# EasyEDA Pro project ProProject_Driver_STM32F405_2023-10-07.epro, schematic Schematic1
Create Date: 2023-02-15; Page Name: P1; Project Name: Driver_STM32F415; Schematic Name: Schematic1; Update Date: 2023-02-21; Company: 嘉立创EDA; Page Size: A4; Version: V1.0
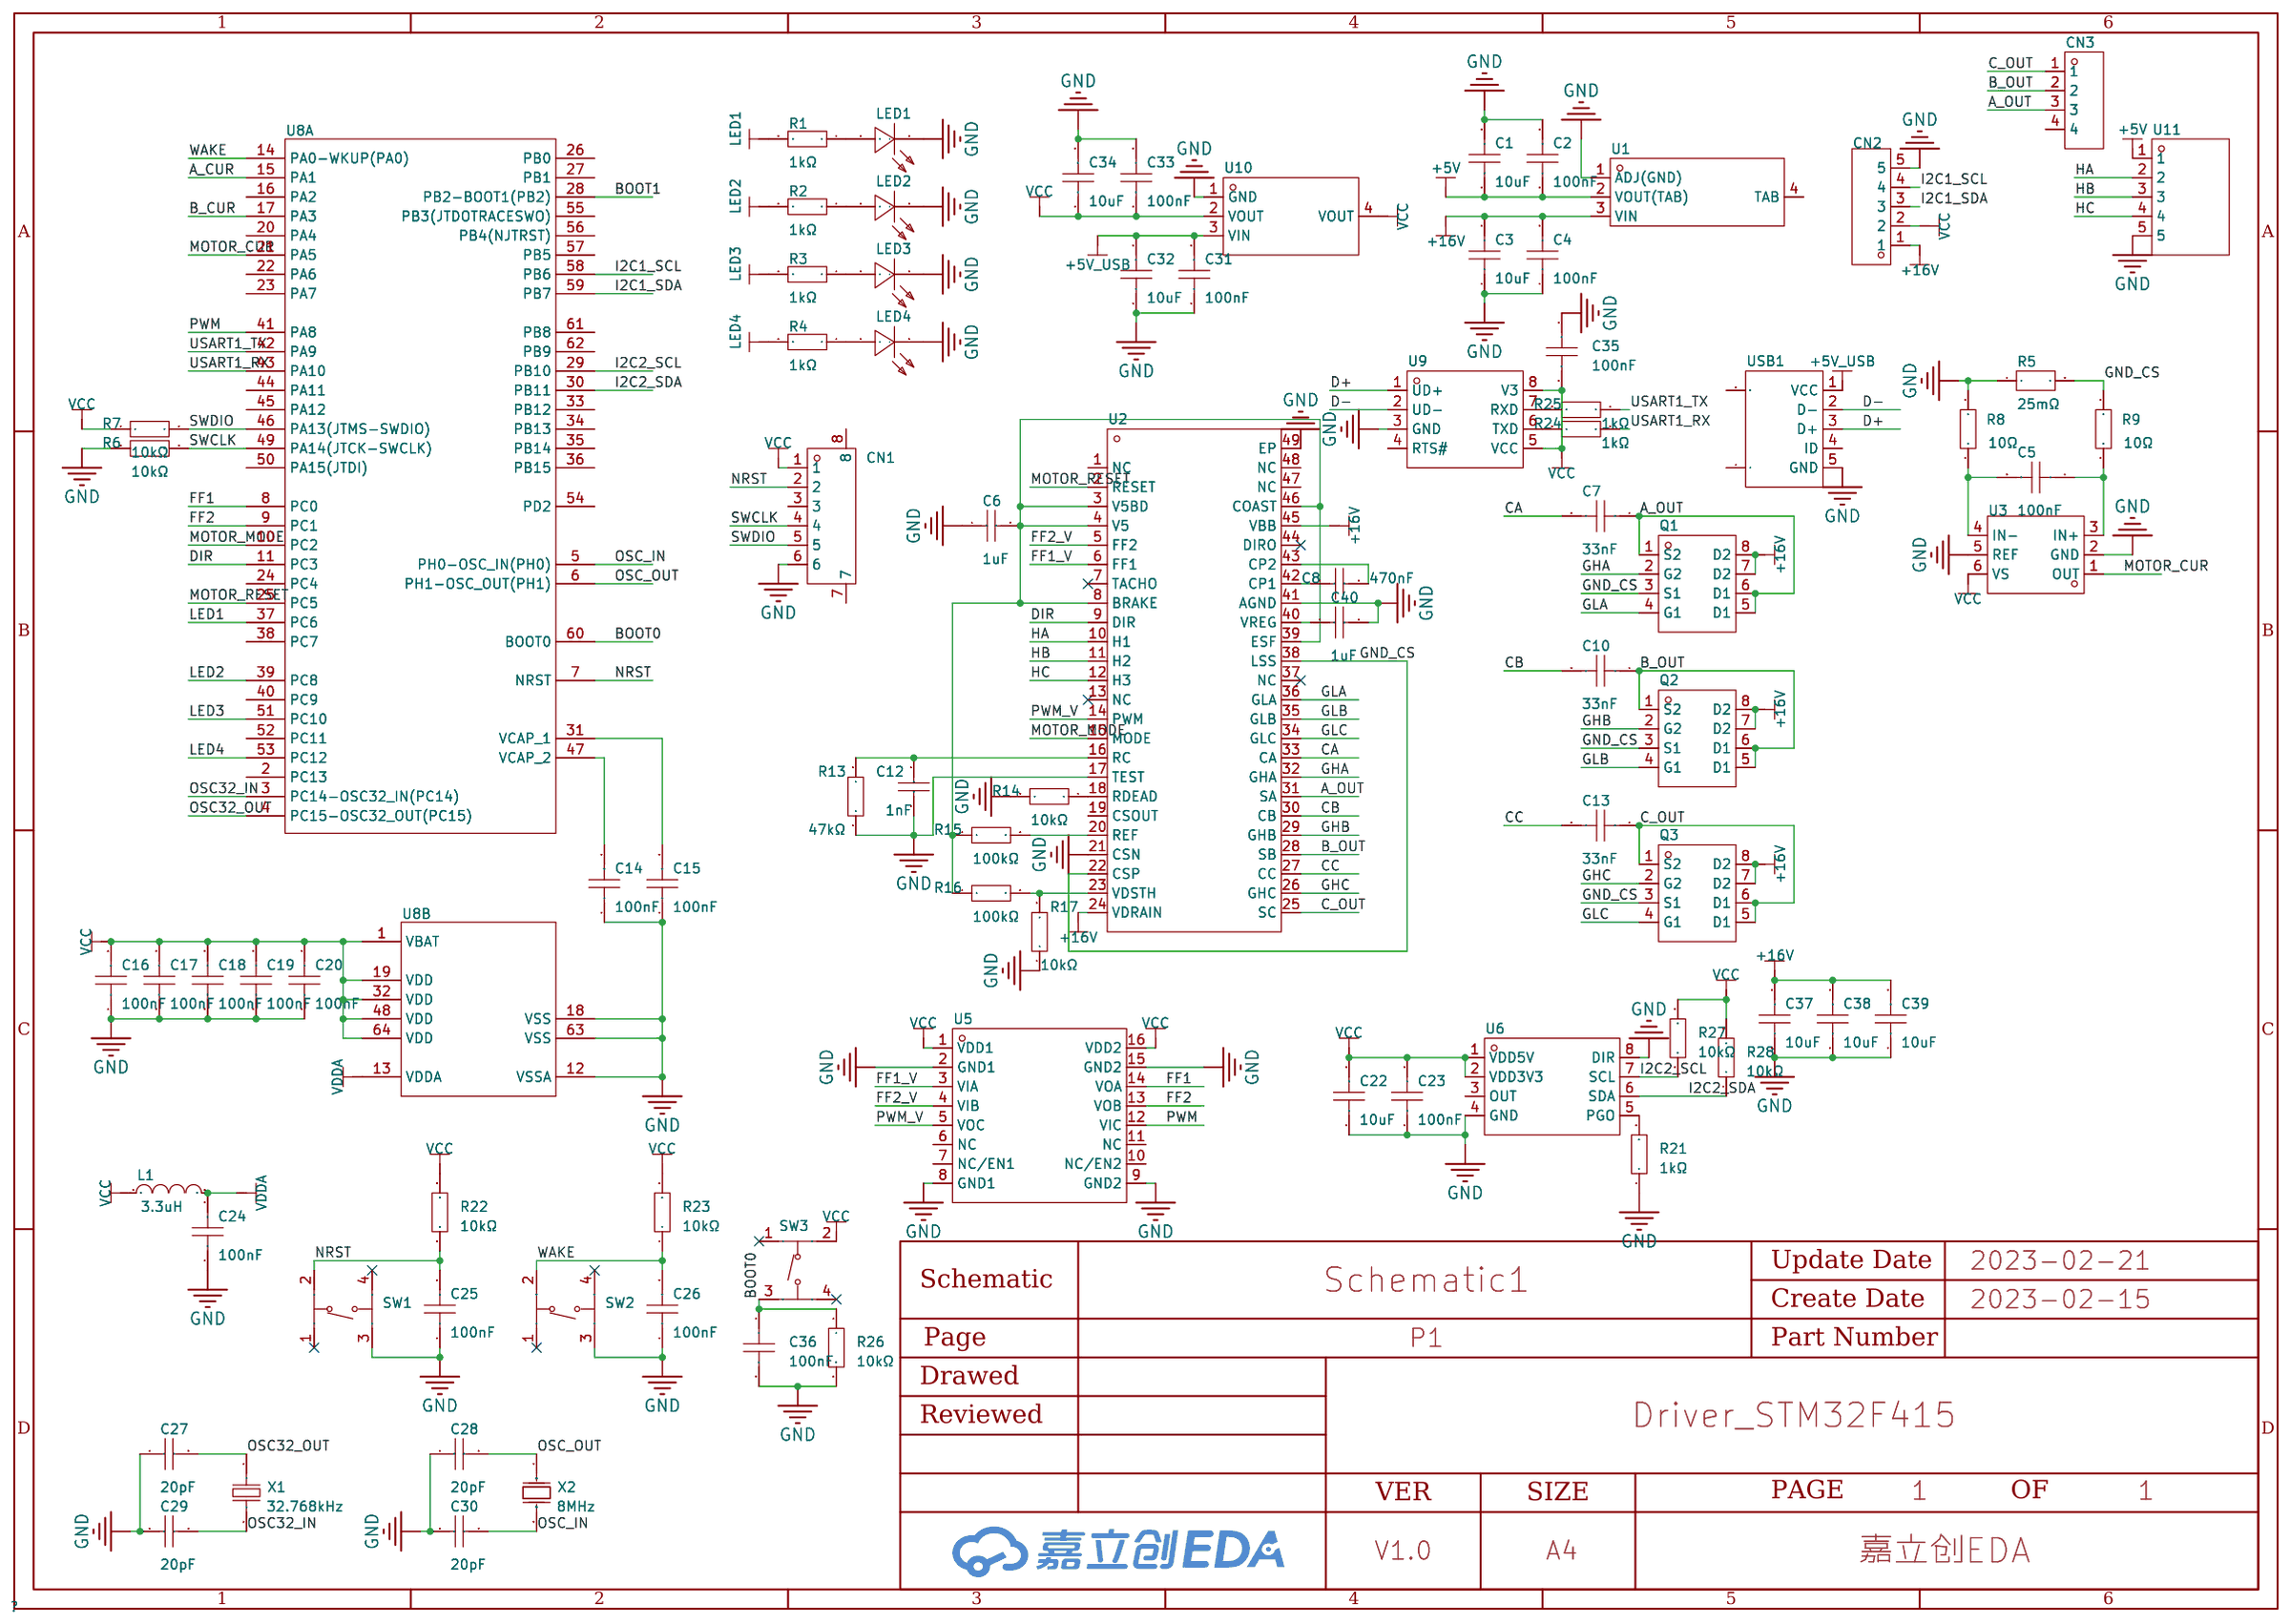
[diagram p0: schematic sheet]

## Parts
C1  10uF  [C0603]
C2  100nF  [C0603]
C3  10uF  [C0603]
C4  100nF  [C0603]
C5  100nF  [C0603]
C6  1uF  [C0603]
C7  33nF  [C0603]
C8  470nF  [C0603]
C10  33nF  [C0603]
C12  1nF  [C0603]
C13  33nF  [C0603]
C14  100nF  [C0603]
C15  100nF  [C0603]
C16  100nF  [C0603]
C17  100nF  [C0603]
C18  100nF  [C0603]
C19  100nF  [C0603]
C20  100nF  [C0603]
C22  10uF  [C0603]
C23  100nF  [C0603]
C24  100nF  [C0603]
C25  100nF  [C0603]
C26  100nF  [C0603]
C27  20pF  [C0603]
C28  20pF  [C0603]
C29  20pF  [C0603]
C30  20pF  [C0603]
C31  100nF  [C0603]
C32  10uF  [C0603]
C33  100nF  [C0603]
C34  10uF  [C0603]
C35  100nF  [C0603]
C36  100nF  [C0603]
C37  10uF  [C1206]
C38  10uF  [C1206]
C39  10uF  [C1206]
C40  1uF  [C0603]
CN1  532610671  [CONN-SMD_6P-P1.25_53261-0671]
CN2  5264-5AWD米色  [CONN-TH_5P-P2.50_5264-5AWD]
CN3  HC-HY-4AW  [CONN-TH_4P-P2.00_HCTL_HC-HY-4AW]
L1  3.3uH  [L0603]
LED1  SZYY0805B  [LED0805-R-RD_BLUE]
LED2  SZYY0805B  [LED0805-R-RD_BLUE]
LED3  SZYY0805B  [LED0805-R-RD_BLUE]
LED4  SZYY0805B  [LED0805-R-RD_BLUE]
Q1  IRF8313PBF  [SOIC-8_L4.9-W3.9-P1.27-LS6.0-BL]
Q2  IRF8313PBF  [SOIC-8_L4.9-W3.9-P1.27-LS6.0-BL]
Q3  IRF8313PBF  [SOIC-8_L4.9-W3.9-P1.27-LS6.0-BL]
R1  1kΩ  [R0603]
R2  1kΩ  [R0603]
R3  1kΩ  [R0603]
R4  1kΩ  [R0603]
R5  25mΩ  [RES-SMD_L6.4-W3.2-R2512]
R6  10kΩ  [R0603]
R7  10kΩ  [R0603]
R8  10Ω  [R0603]
R9  10Ω  [R0603]
R13  47kΩ  [R0603]
R14  10kΩ  [R0603]
R15  100kΩ  [R0603]
R16  100kΩ  [R0603]
R17  10kΩ  [R0603]
R21  1kΩ  [R0603]
R22  10kΩ  [R0603]
R23  10kΩ  [R0603]
R24  1kΩ  [R0603]
R25  1kΩ  [R0603]
R26  10kΩ  [R0603]
R27  10kΩ  [R0603]
R28  10kΩ  [R0603]
SW1  TS-1187A-B-A-B  [SW-SMD_4P-L5.1-W5.1-P3.70-LS6.5-TL-2]
SW2  TS-1187A-B-A-B  [SW-SMD_4P-L5.1-W5.1-P3.70-LS6.5-TL-2]
SW3  TS-1187A-B-A-B  [SW-SMD_4P-L5.1-W5.1-P3.70-LS6.5-TL-2]
U1  AMS1117-5.0  [SOT-223_L6.7-W3.5-P2.30-BR]
U2  A3930KJPTR-T  [LQFP-48_L7.0-W7.0-P0.50-LS9.0-BL-EP]
U3  INA181A1IDBVR  [SOT-23-6_L2.9-W1.6-P0.95-LS2.8-TL]
U5  π131M31  [SOIC-16_L9.9-W3.9-P1.27-LS6.0-BL]
U6  AS5600-ASOT  [SOIC-8_L5.0-W4.0-P1.27-LS6.0-BL]
U8  STM32F405RGT6  [LQFP-64_L10.0-W10.0-P0.50-LS12.0-BL]  (sections 1,2)
U9  CH340N  [SOP-8_L4.9-W3.9-P1.27-LS6.0-BL]
U10  AMS1117-3.3  [SOT-223-3_L6.5-W3.4-P2.30-LS7.0-BR]
U11  B5B-ZR-3.4(LF)(SN)  [CONN-TH_B5B-ZR-3.4-LF-SN]
USB1  MINI 5PTP  [MINI-USB-SMD_MINI-5PTP]
X1  32.768kHz  [FC-135R_L3.2-W1.5]
X2  8MHz  [CRYSTAL-SMD_L5.0-W3.2]

## Library data of the parts
C1 C3 C22 C32 C34 = GRM188C80G106KE47D: 容值:10uF;精度:±10%;额定电压:-;材质(温度系数):-;; LCSC Part Name: 10uF ±10%; Supplier Part: C710916; Manufacturer: muRata(村田); Supplier Footprint: 0603; JLCPCB Part Class: Extended Part; Datasheet: https://atta.szlcsc.com/upload/public/pdf/source/20210205/C710916_8901BCC8D8E6CC54F2C999D22152DEF1.pdf; Supplier: LCSC; Tolerance: ±10%
C2 C4 C5 C14-C20 C23-C26 C31 C33 C35 C36 = TCC0603X7R104K500CT: 容值:100nF;精度:±10%;额定电压:50V;材质(温度系数):X7R;; LCSC Part Name: 100nF ±10% 50V; Supplier Part: C282519; Manufacturer: CCTC(三环); Supplier Footprint: 0603; JLCPCB Part Class: Extended Part; Datasheet: https://atta.szlcsc.com/upload/public/pdf/source/20180917/C282519_8CE721FA29EE85BB321020B63D7877A0.pdf; Supplier: LCSC; Tolerance: ±10%; Voltage Rated: 50V; Temperature Coefficient: X7R
C6 C40 = CL10A105KB8NNNC: 容值:1uF;精度:±10%;额定电压:50V;材质(温度系数):X5R;; LCSC Part Name: 1uF ±10% 50V; Supplier Part: C15849; Manufacturer: SAMSUNG(三星); Supplier Footprint: 0603; JLCPCB Part Class: Basic Part; Datasheet: https://atta.szlcsc.com/upload/public/pdf/source/20160103/1457707679084.pdf; Supplier: LCSC; Tolerance: ±10%; Voltage Rated: 50V; Temperature Coefficient: X5R
C7 C10 C13 = CL10B333JB8NNNC: 容值:33nF;精度:±5%;额定电压:50V;材质(温度系数):X7R;; LCSC Part Name: 33nF ±5% 50V; Supplier Part: C377760; Manufacturer: SAMSUNG(三星); Supplier Footprint: 0603; JLCPCB Part Class: Extended Part; Datasheet: https://atta.szlcsc.com/upload/public/pdf/source/20190322/C377760_4801615B1239BA7CCDCF452430F04471.pdf; Supplier: LCSC; Tolerance: ±5%; Voltage Rated: 50V; Temperature Coefficient: X7R
C8 = 0603B474K500NT: 容值:470nF;精度:±10%;额定电压:50V;材质(温度系数):X7R;; LCSC Part Name: 470nF ±10% 50V; Supplier Part: C77572; Manufacturer: FH(风华); Supplier Footprint: 0603; JLCPCB Part Class: Extended Part; Datasheet: https://atta.szlcsc.com/upload/public/pdf/source/20170923/C77572_1506149543326988941.pdf; Supplier: LCSC; Tolerance: ±10%; Voltage Rated: 50V; Temperature Coefficient: X7R
C12 = CL10B102KB8NNNC: 容值:1nF;精度:±10%;额定电压:50V;材质(温度系数):X7R;; LCSC Part Name: 1nF ±10% 50V; Supplier Part: C1588; Manufacturer: SAMSUNG(三星); Supplier Footprint: 0603; JLCPCB Part Class: Basic Part; Datasheet: https://atta.szlcsc.com/upload/public/pdf/source/20160103/1457707679526.pdf; Supplier: LCSC; Tolerance: ±10%; Voltage Rated: 50V; Temperature Coefficient: X7R
C27-C30 = CL10C200JB8NNNC: 容值:20pF;精度:±5%;额定电压:50V;材质(温度系数):C0G;; LCSC Part Name: 20pF ±5% 50V; Supplier Part: C1648; Manufacturer: SAMSUNG(三星); Supplier Footprint: 0603; JLCPCB Part Class: Basic Part; Datasheet: https://atta.szlcsc.com/upload/public/pdf/source/20160103/1457707686863.pdf; Supplier: LCSC; Tolerance: ±5%; Voltage Rated: 50V; Temperature Coefficient: C0G
C37-C39 = GRM31CB31H106KA12L: 容值:10uF;精度:±10%;额定电压:50V;材质(温度系数):B;; LCSC Part Name: 10uF ±10% 50V; Supplier Part: C521234; Manufacturer: muRata(村田); Supplier Footprint: 1206; JLCPCB Part Class: Extended Part; Datasheet: https://atta.szlcsc.com/upload/public/pdf/source/20200424/C521234_36A2086CC2FC59561FA20FEB9FAD436A.pdf; Supplier: LCSC; Tolerance: ±10%; Voltage Rated: 50V; Temperature Coefficient: B
CN1 = 532610671: 参考系列:-;间距:1.25mm;插针结构:1x6P;排数:1;每排PIN数:6;行距:-;安装方式:-;触头材质:青铜;; LCSC Part Name: 1.25mm 1x6P; Supplier Part: C99277; Manufacturer: MOLEX; JLCPCB Part Class: Extended Part; Datasheet: https://atta.szlcsc.com/upload/public/pdf/source/20180713/C99277_7A4A98FEF11A2209B5FFC17F14BF7E54.pdf; Supplier: LCSC; Pitch: 1.25mm; Pins Structure: 1x6P; Number of Rows: 1; Number of PINs Per Row: 6; Contact Material: 青铜
CN2 = 5264-5AWD米色: 参考系列:-;间距:2.5mm;插针结构:1x5P;排数:1;每排PIN数:5;行距:-;安装方式:-;触头材质:磷青铜;; LCSC Part Name: 5264插座 1*5P 弯针 带定位; Supplier Part: C176652; Manufacturer: BOOMELE(博穆精密); Supplier Footprint: 插件,P=2.5mm; JLCPCB Part Class: Extended Part; Datasheet: https://atta.szlcsc.com/upload/public/pdf/source/20180125/C176652_15168701824541304803.pdf; Supplier: LCSC; Pitch: 2.5mm; Pins Structure: 1x5P; Number of Rows: 1; Number of PINs Per Row: 5; Contact Material: 磷青铜
CN3 = HC-HY-4AW: 参考系列:-;间距:2mm;插针结构:1x4P;排数:1;每排PIN数:4;行距:-;公母:公型插针;安装方式:弯插;额定电流:2A;工作温度范围:-25℃~+85℃;; LCSC Part Name: 2mm 1x4P 弯插; Supplier Part: C2845477; Manufacturer: HCTL(华灿天禄); Supplier Footprint: 插件,P=2mm; JLCPCB Part Class: Extended Part; Datasheet: https://atta.szlcsc.com/upload/public/pdf/source/20210728/C2845475_54E44E53679947D799AB7F887479BA7B.pdf; Supplier: LCSC; Pitch: 2mm; Pins Structure: 1x4P; Number of Rows: 1; Number of PINs Per Row: 4; Gender: 公型插针; Mounting Style: 弯插; Current Rating (Max): 2A; Operating Temperature Range: -25℃~+85℃
L1 = CMI160808U3R3KT: 额定电流:15mA;电感值:3.3uH;精度:±10%;饱和电流(Isat):-;直流电阻(DCR):1Ω;; LCSC Part Name: 3.3uH ±10% 15mA 1Ω; Supplier Part: C139209; Manufacturer: FH(风华); Supplier Footprint: 0603; JLCPCB Part Class: Extended Part; Datasheet: https://atta.szlcsc.com/upload/public/pdf/source/20180412/C139209_76E8EB9664C870BAE46EFE11DEB22A4C.pdf; Supplier: LCSC; Rated Current: 15mA; Tolerance: ±10%; DC Resistance (DCR): 1Ω
LED1-LED4 = SZYY0805B: 发光颜色:蓝灯;二极管配置:-;透镜颜色:无色透明;主波长:460nm~475nm;峰值波长:469nm;色温:-;光通量(25时):-;测试电流:5mA;正向电压(VF):3.1V;发光强度:100mcd;功率:100mW;发光角度:120°;安装方式:-;工作温度:-40~+85;; LCSC Part Name: 蓝灯; Supplier Part: C434433; Manufacturer: yongyu(永裕光电); Supplier Footprint: 0805; JLCPCB Part Class: Extended Part; Datasheet: https://atta.szlcsc.com/upload/public/pdf/source/20191204/C434433_0B90CAB876449C52BDD12D5E48F83BBD.pdf; Supplier: LCSC; Emitted Color: 蓝灯; Lens Color: 无色透明; Dominant Wavelength: 460nm~475nm; Peak Wavelength: 469nm; Forward Current: 5mA; Forward Voltage (VF): 3.1V; Luminous Intensity: 100mcd; Power Dissipation: 100mW; Viewing Angle: 120°; Operating Temperature: -40~+85
Q1-Q3 = IRF8313PBF: 类型:2个N沟道;漏源电压(Vdss):30V;连续漏极电流(Id):9.7A;功率(Pd):2W;导通电阻(RDS(on)@Vgs,Id):15.5mΩ@10V,9.7A;阈值电压(Vgs(th)@Id):2.35V@25uA;; LCSC Part Name: 2个N沟道 30V 9.7A; Supplier Part: C57696; Manufacturer: Infineon(英飞凌); Supplier Footprint: SOIC-8-150mil; JLCPCB Part Class: Extended Part; Datasheet: https://atta.szlcsc.com/upload/public/pdf/source/20180125/C57696_15168616746661301882.pdf; Supplier: LCSC; Type: 2个N沟道; Drain Source Voltage (Vdss): 30V; Continuous Drain Current (Id): 9.7A; Power Dissipation (Pd): 2W; Drain Source On Resistance (RDS(on)@Vgs,Id): 15.5mΩ@10V,9.7A; Gate Threshold Voltage (Vgs(th)@Id): 2.35V@25uA
R1-R4 R21 R24 R25 = 0603WAF1001T5E: 电阻类型:厚膜电阻;阻值:1kΩ;精度:±1%;功率:100mW;温度系数:±100ppm/℃;最大工作电压:75V;工作温度范围:-55℃~+155℃;; LCSC Part Name: 1kΩ ±1% 100mW; Supplier Part: C21190; Manufacturer: UNI-ROYAL(厚声); Supplier Footprint: 0603; JLCPCB Part Class: Basic Part; Datasheet: https://atta.szlcsc.com/upload/public/pdf/source/20200306/C422600_1E6D84923E4A46A82E41ADD87F860B5C.pdf; Supplier: LCSC; Type: 厚膜电阻; Tolerance: ±1%; Power(Watts): 100mW; Temperature Coefficient: ±100ppm/℃; Overload Voltage (Max): 75V; Operating Temperature Range: -55℃~+155℃
R5 = HoJLR2512-3W-25mR-1%: 阻值:25mΩ;精度:±1%;功率:3W;温度系数:±50ppm/℃;工作温度范围:-50℃~+170℃;; LCSC Part Name: 25mΩ ±1% 3W; Supplier Part: C2903480; Manufacturer: Milliohm(毫欧); Supplier Footprint: 2512; JLCPCB Part Class: Extended Part; Datasheet: https://atta.szlcsc.com/upload/public/pdf/source/20211009/7525CABAB363C979E942C1DD41F1FEF0.pdf; Supplier: LCSC; Tolerance: ±1%; Power(Watts): 3W; Temperature Coefficient: ±50ppm/℃; Operating Temperature Range: -50℃~+170℃
R6 R7 R14 R17 R22 R23 R26-R28 = RC0603FR-0710KL: 电阻类型:厚膜电阻;阻值:10kΩ;精度:±1%;功率:100mW;温度系数:±100ppm/℃;最大工作电压:75V;工作温度范围:-55℃~+155℃;; LCSC Part Name: 10kΩ ±1% 100mW; Supplier Part: C98220; Manufacturer: YAGEO(国巨); Supplier Footprint: 0603; JLCPCB Part Class: Extended Part; Datasheet: https://atta.szlcsc.com/upload/public/pdf/source/20170522/1495423494387.pdf; Supplier: LCSC; Type: 厚膜电阻; Tolerance: ±1%; Power(Watts): 100mW; Temperature Coefficient: ±100ppm/℃; Overload Voltage (Max): 75V; Operating Temperature Range: -55℃~+155℃
R8 R9 = WR06X10R0FTL: 阻值:10Ω;精度:±1%;功率:100mW;温度系数:-200ppm/℃~+400ppm/℃;最大工作电压:75V;工作温度范围:-55℃~+155℃;; LCSC Part Name: 10Ω ±1% 100mW; Supplier Part: C163851; Manufacturer: Walsin(华新科); Supplier Footprint: 0603; JLCPCB Part Class: Extended Part; Datasheet: https://atta.szlcsc.com/upload/public/pdf/source/20180228/C163851_15198053541131377224.pdf; Supplier: LCSC; Tolerance: ±1%; Power(Watts): 100mW; Temperature Coefficient: -200ppm/℃~+400ppm/℃; Overload Voltage (Max): 75V; Operating Temperature Range: -55℃~+155℃
R13 = 0603WAF4702T5E: 精度:±1%;温度系数:±100ppm/℃;功率:1/10W;阻值:47kΩ;最大工作电压:75V;工作温度范围:-55℃~+155℃;; LCSC Part Name: 47KΩ ±1%; Supplier Part: C25819; Manufacturer: UNI-ROYAL(厚声); Supplier Footprint: 0603; JLCPCB Part Class: Basic Part; Datasheet: https://atta.szlcsc.com/upload/public/pdf/source/20170920/C25819_1505901557326983389.pdf; Supplier: LCSC; Tolerance: ±1%; Temperature Coefficient: ±100ppm/℃; Power(Watts): 1/10W; Overload Voltage (Max): 75V; Operating Temperature Range: -55℃~+155℃
R15 R16 = 0603WAF1003T5E: 电阻类型:厚膜电阻;阻值:100kΩ;精度:±1%;功率:100mW;温度系数:±100ppm/℃;最大工作电压:75V;工作温度范围:-55℃~+155℃;; LCSC Part Name: 100kΩ ±1% 100mW; Supplier Part: C25803; Manufacturer: UNI-ROYAL(厚声); Supplier Footprint: 0603; JLCPCB Part Class: Basic Part; Datasheet: https://atta.szlcsc.com/upload/public/pdf/source/20200306/C422600_1E6D84923E4A46A82E41ADD87F860B5C.pdf; Supplier: LCSC; Type: 厚膜电阻; Tolerance: ±1%; Power(Watts): 100mW; Temperature Coefficient: ±100ppm/℃; Overload Voltage (Max): 75V; Operating Temperature Range: -55℃~+155℃
SW1-SW3 = TS-1187A-B-A-B: 触点电流:50mA;额定电压(DC):12V;绝缘电阻:-;电路结构:单刀单掷;安装方式:立贴;按钮形状:圆形按钮;按钮/盖帽颜色:金色;带灯:无;作用力:160gf;机械寿命:100000;工作温度:-30℃~+85℃;开关长度:5.1mm;开关宽度:5.1mm;开关高度:1.5mm;带支架:否;; LCSC Part Name: 5.1*5.1*1.5 防水金属头160gf; Supplier Part: C318884; Manufacturer: XKB Connectivity(中国星坤); Supplier Footprint: SMD; JLCPCB Part Class: Basic Part; Datasheet: https://atta.szlcsc.com/upload/public/pdf/source/20200227/C318884_1F20165719E1C4CAA3E10C4C359C6E26.pdf; Supplier: LCSC; Contact Current: 50mA; Voltage Rating (DC): 12V; Circuit: 单刀单掷; Mounting Style: 立贴; Actuator Style: 圆形按钮; Actuator/Cap Color: 金色; With Lamp: 无; Operating Force: 160gf; Mechanical Life: 100000; Operating Temperature: -30℃~+85℃; Switch Length: 5.1mm; Switch Width: 5.1mm; Switch Height: 1.5mm; Strike Gundam: 否
U1 = AMS1117-5.0_C347223: Supplier Part: C347223; Manufacturer: UMW(广东友台半导体); Supplier Footprint: SOT-223; JLCPCB Part Class: Extended Part; Datasheet: https://atta.szlcsc.com/upload/public/pdf/source/20181213/C347223_0BE2B698C4D09A2D316464DFECA0C193.pdf; Supplier: LCSC
U2 = A3930KJPTR-T: 电源电压:5.5V~50V;输出电流:-;接口:并行;; LCSC Part Name: 电机驱动芯片; Supplier Part: C459252; Manufacturer: ALLEGRO(美国埃戈罗); Supplier Footprint: LQFP-48(7x7); JLCPCB Part Class: Extended Part; Datasheet: https://atta.szlcsc.com/upload/public/pdf/source/20200518/C459252_E214869B5841466FF326F30C716B8FBE.pdf; Supplier: LCSC; Type: 无刷直流BLDC; Supply Voltage: 5.5V~50V; Interface: 并行; Operating Temperature: -40℃~+150℃@(Ta)
U3 = INA181A1IDBVR: Supplier Part: C2058943; Manufacturer: TI(德州仪器); Supplier Footprint: SOT-23-6; JLCPCB Part Class: Extended Part; Supplier: LCSC
U5 = π131M31: 应用:-;隔离技术:-;通道数:3;正向通道数:2;反向通道数:1;是否带电压隔离:不带电压隔离;隔离电压(Viso):3000Vrms;数据速率:10Mbps;电源电压(Vdd):3V~5.5V;工作温度:-;; Supplier Part: C471599; Manufacturer: 2Pai Semi(荣湃); Supplier Footprint: SOIC-16; JLCPCB Part Class: Extended Part; Datasheet: https://atta.szlcsc.com/upload/public/pdf/source/20191223/C471599_988A4EE6AAB89FD55484F1653132A8AB.pdf; Supplier: LCSC; Number of Channels: 3; Forward Channel: 2; Reverse channel: 1; Voltage Isolation or Not: 不带电压隔离; Isolation voltage: 3000Vrms; Data Rate: 10Mbps; Supply Voltage: 3V~5.5V
U6 = AS5600-ASOT: Supplier Part: C499458; Manufacturer: ams(艾迈斯半导体); Supplier Footprint: SOIC-8; JLCPCB Part Class: Extended Part; Datasheet: https://atta.szlcsc.com/upload/public/pdf/source/20200324/C499458_E1461AFB0CE1042DE5756821C534625C.pdf; Supplier: LCSC
U8 = STM32F405RGT6: CPU内核:ARM Cortex-M4;CPU最大主频:168MHz;工作电压范围:1.8V~3.6V;内部振荡器:有;程序 FLASH容量:1MB;RAM总容量:192KB;EEPROM/数据 FLASH容量:-;GPIO端口数量:51;ADC(单元数/通道数/位数):1@x16ch/12bit;DAC(单元数/通道数/位数):1@x2ch/12bit;外设/功能/协议栈:欠压检测/复位；DMA；LCD驱动；看门狗；POR；PWM;工作温度范围:-40℃~+85℃;; LCSC Part Name: ARM Cortex-M4 168MHz 闪存：1MB RAM：192KB; Supplier Part: C15742; Manufacturer: ST(意法半导体); Supplier Footprint: LQFP-64(10x10); JLCPCB Part Class: Extended Part; Datasheet: https://atta.szlcsc.com/upload/public/pdf/source/20140724/1457707160365.pdf; Supplier: LCSC; CPU Core: ARM Cortex-M4; Maximum Frequency: 168MHz; Supply Voltage Range: 1.8V~3.6V; Internal Oscillator: 有; Program FLASH Size: 1MB; RAM Size: 192KB; GPIO Ports Number: 51; ADC (Units/Channels/bits): 1@x16ch/12bit; DAC (Units/Channels/bits): 1@x2ch/12bit; Peripherals / Functions / Protocol Stacks: 欠压检测/复位；DMA；LCD驱动；看门狗；POR；PWM; Operating Temperature Range: -40℃~+85℃
U9 = CH340N: Supplier Part: C2977777; Manufacturer: WCH(南京沁恒); Supplier Footprint: SOP-8; JLCPCB Part Class: Extended Part; Datasheet: https://atta.szlcsc.com/upload/public/pdf/source/20220223/82A45E4FF89B3EDCAD50B354450A7EF4.pdf; Supplier: LCSC
U10 = AMS1117-3.3_C6186: 输出类型:固定;输出极性:正;输出通道数:1;最大输入电压:-;输出电压:3.3V;压差:1.3V@(800mA);静态电流(地电流):-;输出电流:1A;电源纹波抑制比(PSRR):72dB@(120Hz);噪声:-;特性:-;工作温度:-;; LCSC Part Name: 正 Vout=3.3V 1A 72dB@(120Hz); Supplier Part: C6186; Manufacturer: AMS; Supplier Footprint: SOT-223-3; JLCPCB Part Class: Basic Part; Datasheet: https://atta.szlcsc.com/upload/public/pdf/source/20180727/C6186_7A095716F0823C02F1997A905E26C086.pdf; Supplier: LCSC; Output Type: 固定; Output Polarity: 正; Number of Outputs: 1; Output Voltage: 3.3V; Dropout Voltage: 1.3V@(800mA); Output Current: 1A; Power Supply Rejection Ratio (PSRR): 72dB@(120Hz)
U11 = B5B-ZR-3.4(LF)(SN): 参考系列:-;间距:1.5mm;插针结构:1x5P;排数:1;每排PIN数:5;行距:-;安装方式:-;触头材质:黄铜;; LCSC Part Name: 1.5mm 1x5P; Supplier Part: C265291; Manufacturer: JST; Supplier Footprint: 插件,P=1.5mm; JLCPCB Part Class: Extended Part; Datasheet: https://atta.szlcsc.com/upload/public/pdf/source/20181024/C265291_AF00F487F7C2C67BBDB00521FA4CEA2F.pdf; Supplier: LCSC; Pitch: 1.5mm; Pins Structure: 1x5P; Number of Rows: 1; Number of PINs Per Row: 5; Contact Material: 黄铜
USB1 = MINI 5PTP: 连接器类型:Mini-B;标准:USB 2.0;公母:母座;触点数量:5;端口数量:1;安装方式:卧贴;额定电流 - 电源:1A;工作温度范围:-30℃~+80℃;; LCSC Part Name: Mini-B 母座 卧贴 铁壳 盘装; Supplier Part: C2681563; Manufacturer: SHOU HAN(首韩); Supplier Footprint: SMD; JLCPCB Part Class: Extended Part; Datasheet: https://atta.szlcsc.com/upload/public/pdf/source/20210122/C2681563_5D04D24BBA4C56EC4906A22CA4EB95CA.pdf; Supplier: LCSC; Connector Type: Mini-B; Standard: USB 2.0; Gender: 母座; Number of Contacts: 5; Number of Ports: 1; Mounting Style: 卧贴; Current Rating - Power (Max): 1A; Operating Temperature Range: -30℃~+80℃
X1 = Q13FC1350000400: 晶振类型:贴片无源晶振;频率:32.768kHz;频率公差:±20ppm;负载电容:12.5pF;等效串联电阻(ESR):70kΩ;工作温度:-40℃~+85℃;; LCSC Part Name: 32.768kHz ±20ppm 12.5pF; Supplier Part: C32346; Manufacturer: EPSON(爱普生); Supplier Footprint: SMD3215-2P; JLCPCB Part Class: Basic Part; Datasheet: https://atta.szlcsc.com/upload/public/pdf/source/20190108/C32346_746D6B07EAF90824457A96480007685F.pdf; Supplier: LCSC; Crystal Type: 贴片无源晶振; Frequency Tolerance: ±20ppm; Load Capacitance: 12.5pF; Equivalent Series Resistance (ESR): 70kΩ; Operating Temperature: -40℃~+85℃
X2 = X50328MSB2GI: 晶振类型:贴片无源晶振;频率:8MHz;频率公差:±10ppm;频率稳定度:±50ppm;负载电容:20pF;工作温度:-40℃~+85℃;; LCSC Part Name: YSX530GA 8MHz ±10ppm 20pF; Supplier Part: C115962; Manufacturer: YXC(扬兴晶振); Supplier Footprint: SMD5032-2P; JLCPCB Part Class: Basic Part; Datasheet: https://atta.szlcsc.com/upload/public/pdf/source/20210329/C112559_847D3CACBA33ACCEB57DEA3AEBB187A1.pdf; Supplier: LCSC; Crystal Type: 贴片无源晶振; Frequency Tolerance: ±10ppm; Frequency Stability: ±50ppm; Load Capacitance: 20pF; Operating Temperature: -40℃~+85℃

## Nets
+5V: C1.1 C2.1 U1.2(VOUT(TAB)) U11.1
+5V_USB: C31.2 C32.2 U10.3(VIN) USB1.1(VCC)
+16V: C3.2 C4.2 C37.2 C38.2 C39.2 CN2.1 Q1.7(D2) Q1.8(D2) Q2.7(D2) Q2.8(D2) Q3.7(D2) Q3.8(D2) U1.3(VIN) U2.24(VDRAIN) U2.45(VBB)
GND: C1.2 C2.2 C3.1 C4.1 C6.1 C12.1 C14.1 C15.1 C16.1 C17.1 C18.1 C19.1 C20.1 C22.1 C23.1 C24.1 C25.1 C26.1 C27.1 C28.1 C29.1 C30.1 C31.1 C32.1 C33.2 C34.2 C35.1 C36.2 C37.1 C38.1 C39.1 C40.2 CN1.6 CN2.5 LED1.2(-) LED2.2(-) LED3.2(-) LED4.2(-) R5.1 R6.1 R8.2 R13.1 R14.2 R17.1 R21.1 R26.2 SW1.3(C) SW2.3(C) U1.1(ADJ(GND)) U2.17(TEST) U2.21(CSN) U2.41(AGND) U2.49(EP) U3.2(GND) U3.5(REF) U5.2(GND1) U5.8(GND1) U5.9(GND2) U5.15(GND2) U6.4(GND) U6.8(DIR) U8.12(VSSA) U8.18(VSS) U8.63(VSS) U9.3(GND) U10.1(GND) U11.5 USB1.5(GND)
GND_CS: Q1.3(S1) Q2.3(S1) Q3.3(S1) R5.2 R9.2 U2.22(CSP) U2.38(LSS)
VCC: C16.2 C17.2 C18.2 C19.2 C20.2 C22.2 C23.2 C33.1 C34.1 C35.2 CN1.1 CN2.2 L1.1 R7.1 R22.2 R23.2 R27.2 R28.2 SW3.2(B) U3.6(VS) U5.1(VDD1) U5.16(VDD2) U6.1(VDD5V) U6.2(VDD3V3) U8.1(VBAT) U8.19(VDD) U8.32(VDD) U8.48(VDD) U8.64(VDD) U9.5(VCC) U9.8(V3) U10.2(VOUT) U10.4(VOUT)
VDDA: C24.2 L1.2 U8.13(VDDA)
A_CUR: U8.15(PA1)
A_OUT: C7.1 CN3.3 Q1.1(S2) Q1.5(D1) Q1.6(D1) U2.31(SA)
B_CUR: U8.17(PA3)
B_OUT: C10.1 CN3.2 Q2.1(S2) Q2.5(D1) Q2.6(D1) U2.28(SB)
BOOT0: C36.1 R26.1 SW3.3(C) U8.60(BOOT0)
BOOT1: U8.28(PB2-BOOT1(PB2))
C_OUT: C13.1 CN3.1 Q3.1(S2) Q3.5(D1) Q3.6(D1) U2.25(SC)
CA: C7.2 U2.33(CA)
CB: C10.2 U2.30(CB)
CC: C13.2 U2.27(CC)
D+: U9.1(UD+) USB1.3(D+)
D-: U9.2(UD-) USB1.2(D-)
DIR: U2.9(DIR) U8.11(PC3)
FF1: U5.14(VOA) U8.8(PC0)
FF1_V: U2.6(FF1) U5.3(VIA)
FF2: U5.13(VOB) U8.9(PC1)
FF2_V: U2.5(FF2) U5.4(VIB)
GHA: Q1.2(G2) U2.32(GHA)
GHB: Q2.2(G2) U2.29(GHB)
GHC: Q3.2(G2) U2.26(GHC)
GLA: Q1.4(G1) U2.36(GLA)
GLB: Q2.4(G1) U2.35(GLB)
GLC: Q3.4(G1) U2.34(GLC)
HA: U2.10(H1) U11.2
HB: U2.11(H2) U11.3
HC: U2.12(H3) U11.4
I2C1_SCL: CN2.4 U8.58(PB6)
I2C1_SDA: CN2.3 U8.59(PB7)
I2C2_SCL: R27.1 U6.7(SCL) U8.29(PB10)
I2C2_SDA: R28.1 U6.6(SDA) U8.30(PB11)
LED1: R1.2 U8.37(PC6)
LED2: R2.2 U8.39(PC8)
LED3: R3.2 U8.51(PC10)
LED4: R4.2 U8.53(PC12)
MOTOR_CUR: U3.1(OUT) U8.21(PA5)
MOTOR_MODE: U2.15(MODE) U8.10(PC2)
MOTOR_RESET: U2.2(RESET) U8.25(PC5)
NRST: C25.2 CN1.2 R22.1 SW1.2(B) U8.7(NRST)
OSC32_IN: C29.2 U8.3(PC14-OSC32_IN(PC14)) X1.2
OSC32_OUT: C27.2 U8.4(PC15-OSC32_OUT(PC15)) X1.1
OSC_IN: C30.2 U8.5(PH0-OSC_IN(PH0)) X2.2(OSC2)
OSC_OUT: C28.2 U8.6(PH1-OSC_OUT(PH1)) X2.1(OSC1)
PWM: U5.12(VIC) U8.41(PA8)
PWM_V: U2.14(PWM) U5.5(VOC)
SWCLK: CN1.4 R6.2 U8.49(PA14(JTCK-SWCLK))
SWDIO: CN1.5 R7.2 U8.46(PA13(JTMS-SWDIO))
USART1_RX: R24.1 U8.43(PA10)
USART1_TX: R25.1 U8.42(PA9)
WAKE: C26.2 R23.1 SW2.2(B) U8.14(PA0-WKUP(PA0))
$1N4505: C14.2 U8.47(VCAP_2)
$1N4511: C15.2 U8.31(VCAP_1)
$1N14634: C5.2 R8.1 U3.4(IN-)
$1N14640: C5.1 R9.1 U3.3(IN+)
$1N21748: C8.1 U2.42(CP1)
$1N21864: C8.2 U2.43(CP2)
$1N22637: C12.2 R13.2 U2.16(RC)
$1N23232: C40.1 U2.40(VREG)
$1N23481: C6.2 R15.1 R16.1 U2.3(V5BD) U2.4(V5) U2.8(BRAKE) U2.39(ESF) U2.46(COAST)
$1N24997: R15.2 U2.20(REF)
$1N25176: R16.2 R17.2 U2.23(VDSTH)
$1N27489: R14.1 U2.18(RDEAD)
$1N33277: R21.2 U6.5(PGO)
$1N35265: LED1.1(+) R1.1
$1N35679: LED2.1(+) R2.1
$1N35970: LED3.1(+) R3.1
$1N38182: LED4.1(+) R4.1
$1N41619: R24.2 U9.6(TXD)
$1N41797: R25.2 U9.7(RXD)

Not connected (* = marked no-connect by the designer): CN1 3 7 8; CN3 4; SW1 1(A)* 4(D)*; SW2 1(A)* 4(D)*; SW3 1(A)* 4(D)*; U1 4(TAB); U2 1(NC) 7(TACHO)* 13(NC)* 19(CSOUT) 37(NC)* 44(DIRO)* 47(NC) 48(NC); U5 6(NC) 7(NC/EN1) 10(NC/EN2) 11(NC); U6 3(OUT); U8 2(PC13) 16(PA2) 20(PA4) 22(PA6) 23(PA7) 24(PC4) 26(PB0) 27(PB1) 33(PB12) 34(PB13) 35(PB14) 36(PB15) 38(PC7) 40(PC9) 44(PA11) 45(PA12) 50(PA15(JTDI)) 52(PC11) 54(PD2) 55(PB3(JTDOTRACESWO)) 56(PB4(NJTRST)) 57(PB5) 61(PB8) 62(PB9); U9 4(RTS#); USB1 4(ID) 6 7
